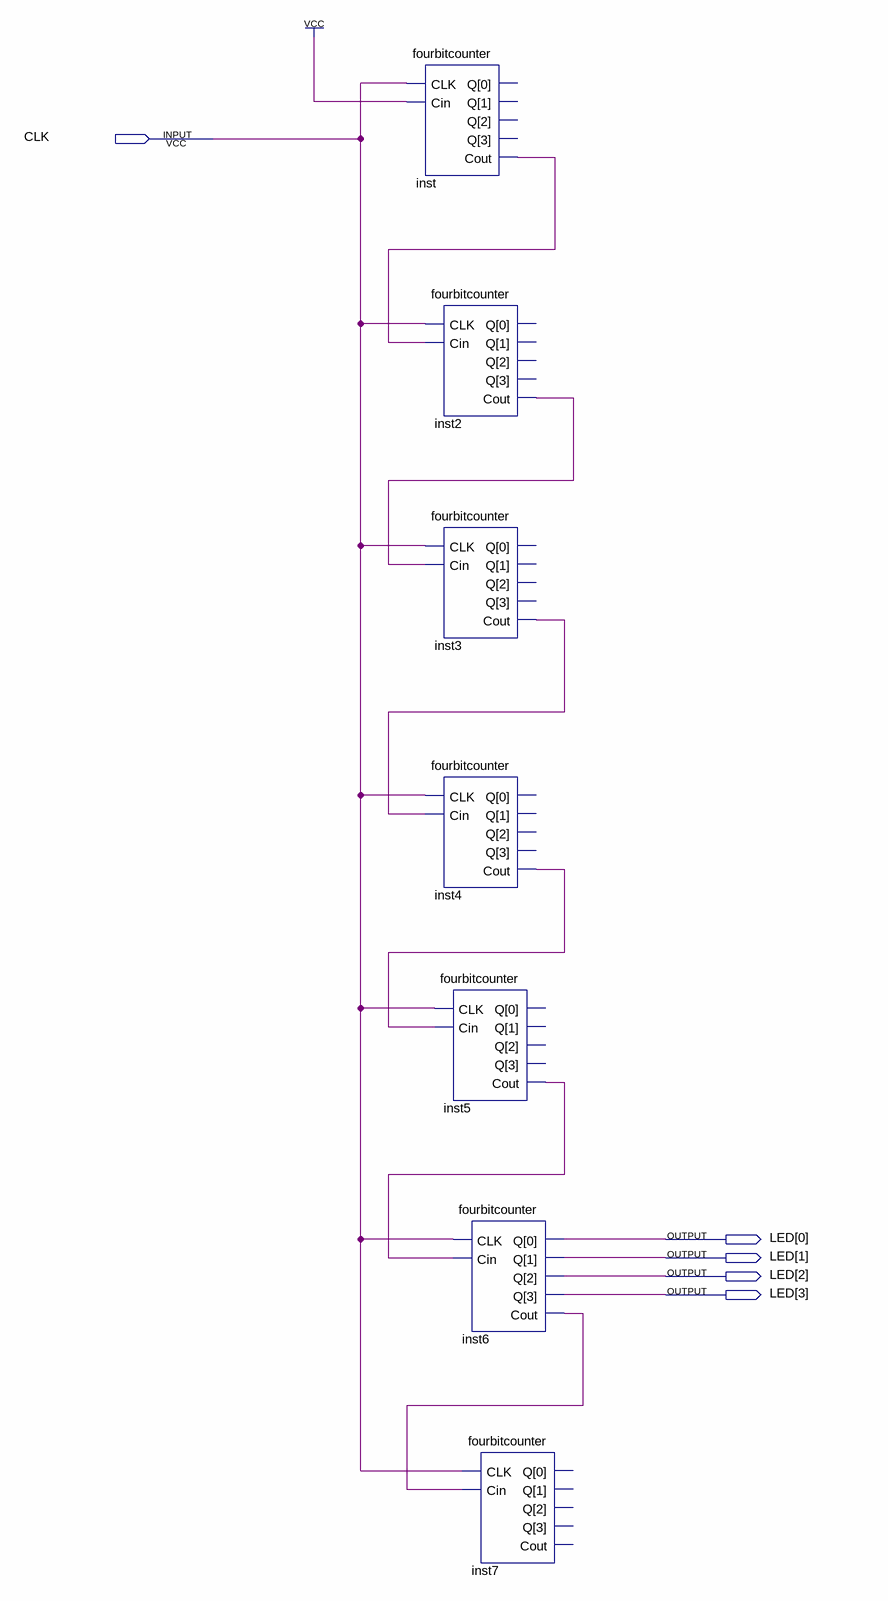
[diagram p0: schematic sheet]
// Quartus schematic sematik3_top.bdf as structural Verilog: 7 symbols, 5 pins
module sematik3_top (
  input  CLK,
  output [3:0] LED
);

  wire inst2_cout, inst3_cout, inst4_cout, inst5_cout, inst6_cout, inst_cout;

  fourbitcounter inst (.CLK(CLK), .Cin(1'b1), .Cout(inst_cout));  // open: Q
  fourbitcounter inst2 (.CLK(CLK), .Cin(inst_cout), .Cout(inst2_cout));  // open: Q
  fourbitcounter inst3 (.CLK(CLK), .Cin(inst2_cout), .Cout(inst3_cout));  // open: Q
  fourbitcounter inst4 (.CLK(CLK), .Cin(inst3_cout), .Cout(inst4_cout));  // open: Q
  fourbitcounter inst5 (.CLK(CLK), .Cin(inst4_cout), .Cout(inst5_cout));  // open: Q
  fourbitcounter inst6 (.CLK(CLK), .Cin(inst5_cout), .Q(LED), .Cout(inst6_cout));
  fourbitcounter inst7 (.CLK(CLK), .Cin(inst6_cout));  // open: Q, Cout
endmodule
